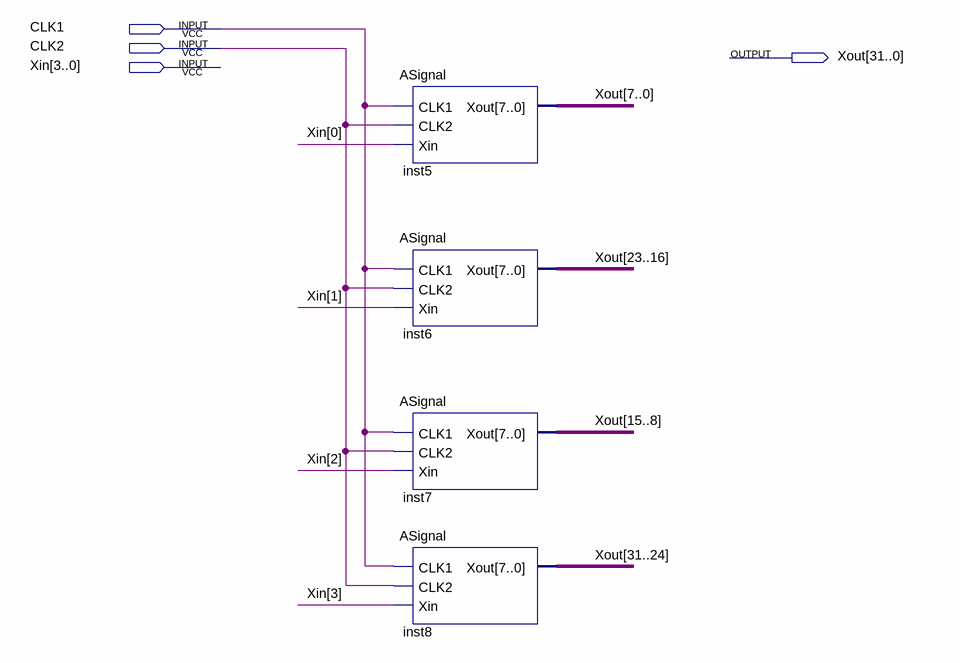
[diagram p0: schematic sheet]
// Quartus schematic QSignal.bdf as structural Verilog: 4 symbols, 4 pins
module QSignal (
  input  CLK1,
  input  CLK2,
  input  [3:0] Xin,
  output [31:0] Xout
);

  ASignal inst5 (.CLK1(CLK1), .CLK2(CLK2), .Xin(Xin[0]), .Xout(Xout[7:0]));
  ASignal inst6 (.CLK1(CLK1), .CLK2(CLK2), .Xin(Xin[1]), .Xout(Xout[23:16]));
  ASignal inst7 (.CLK1(CLK1), .CLK2(CLK2), .Xin(Xin[2]), .Xout(Xout[15:8]));
  ASignal inst8 (.CLK1(CLK1), .CLK2(CLK2), .Xin(Xin[3]), .Xout(Xout[31:24]));
endmodule
